# EAGLE schematic scheme (EAGLE 7.5.0)
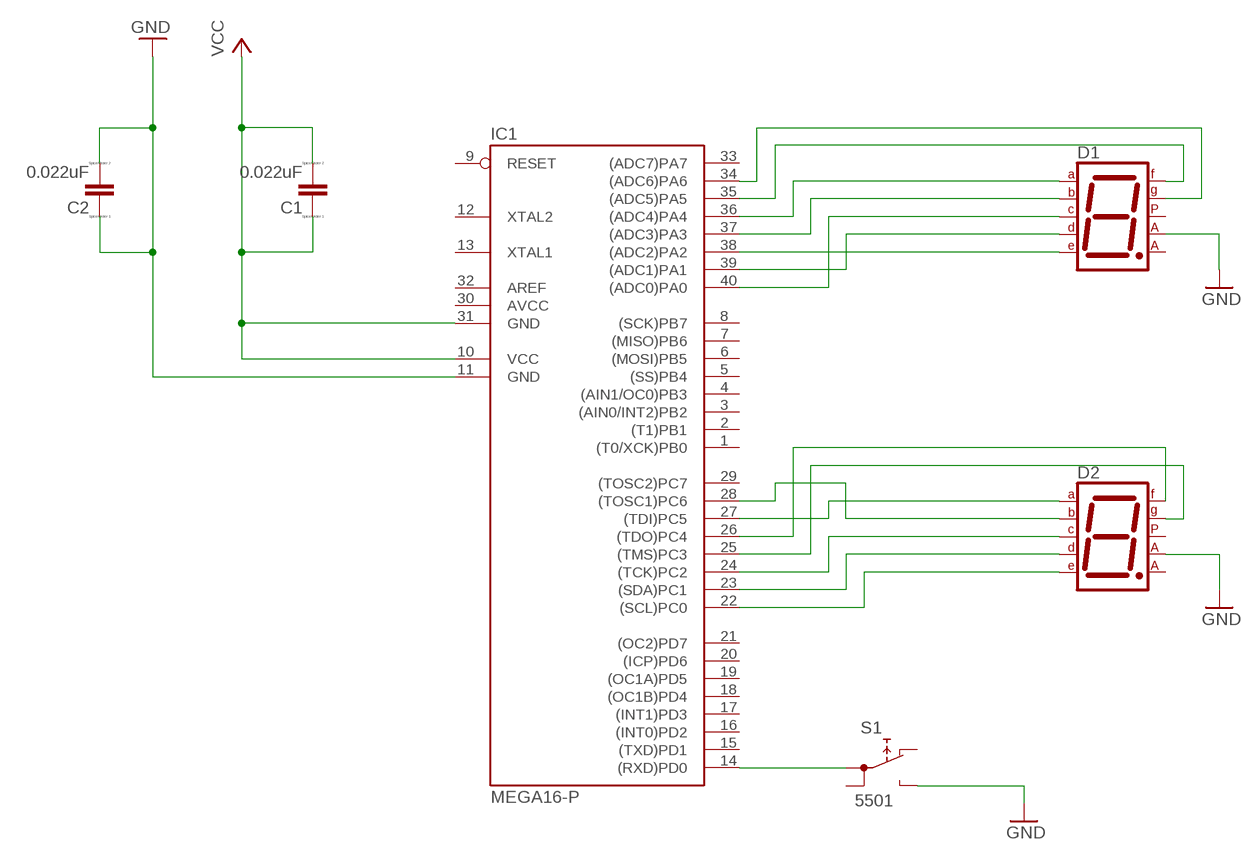
[diagram p0: schematic, sheet 1]

## Parts
C1  0.022uF  C  [C0805]
C2  0.022uF  C  [C0805]
D1  7SEG-CA  [7SEG-13]
D2  7SEG-CA  [7SEG-13]
IC1  MEGA16-P  [DIL40]
S1  5501  [5501]

## Nets
GND: C2.1 C2.2 D1.3(CA1) D2.3(CA1) IC1.11(GND) S1.NO
N$1: D1.4(C) IC1.40((ADC0)PA0)
N$2: D1.2(D) IC1.39((ADC1)PA1)
N$3: D1.1(E) IC1.38((ADC2)PA2)
N$4: D1.6(B) IC1.37((ADC3)PA3)
N$5: D1.7(A) IC1.36((ADC4)PA4)
N$6: D1.9(F) IC1.35((ADC5)PA5)
N$7: D1.10(G) IC1.34((ADC6)PA6)
N$8: D2.1(E) IC1.22((SCL)PC0)
N$9: D2.2(D) IC1.23((SDA)PC1)
N$10: D2.4(C) IC1.24((TCK)PC2)
N$11: D2.10(G) IC1.25((TMS)PC3)
N$12: D2.9(F) IC1.26((TDO)PC4)
N$13: D2.7(A) IC1.27((TDI)PC5)
N$14: D2.6(B) IC1.28((TOSC1)PC6)
N$15: IC1.14((RXD)PD0) S1.1A
VCC: C1.1 C1.2 IC1.10(VCC) IC1.31(GND)
Unconnected: D1.5(DP) D1.8(CA2) D2.5(DP) D2.8(CA2) IC1.1((T0/XCK)PB0) IC1.2((T1)PB1) IC1.3((AIN0/INT2)PB2) IC1.4((AIN1/OC0)PB3) IC1.5((SS)PB4) IC1.6((MOSI)PB5) IC1.7((MISO)PB6) IC1.8((SCK)PB7) IC1.9(RESET) IC1.12(XTAL2) IC1.13(XTAL1) IC1.15((TXD)PD1) IC1.16((INT0)PD2) IC1.17((INT1)PD3) IC1.18((OC1B)PD4) IC1.19((OC1A)PD5) IC1.20((ICP)PD6) IC1.21((OC2)PD7) IC1.29((TOSC2)PC7) IC1.32(AREF) IC1.33((ADC7)PA7) S1.1B S1.NC

## Power pins joined to a net without a drawn wire
AVCC: IC1.30(AVCC)

## Library data of the parts
C1 C2 = eagle-ltspice:C: CAPACITOR, European symbol; SPICEMODEL: NONE; SPICEPREFIX: C
D1 D2 = special:7SEG-CA: 7-segment DISPLAY single anode, 13 mm
IC1 = atmel:MEGA16-P: MICROCONTROLLER 16 Kbytes FLASH 1 kbytes SRAM 512 bytes EEPROM USART 8-channel 10 bit ADC Source: avr.lbr; MPN: ATMEGA16-16PU; OC_FARNELL: 9171142; OC_NEWARK: 01M6885
S1 = switch:55?: PUSHBUTTON SERIES 5500 SWITCHES Source: www.e-switch.com .. 5500.pdf